# Altium schematic sheet Therms.SchDoc: Thermistor Fusing & Splitter
size A; DrawnBy: Matthew McCauley; Address4: 2.2.1; Revision: 1; SheetNumber: 1; SheetTotal: 1
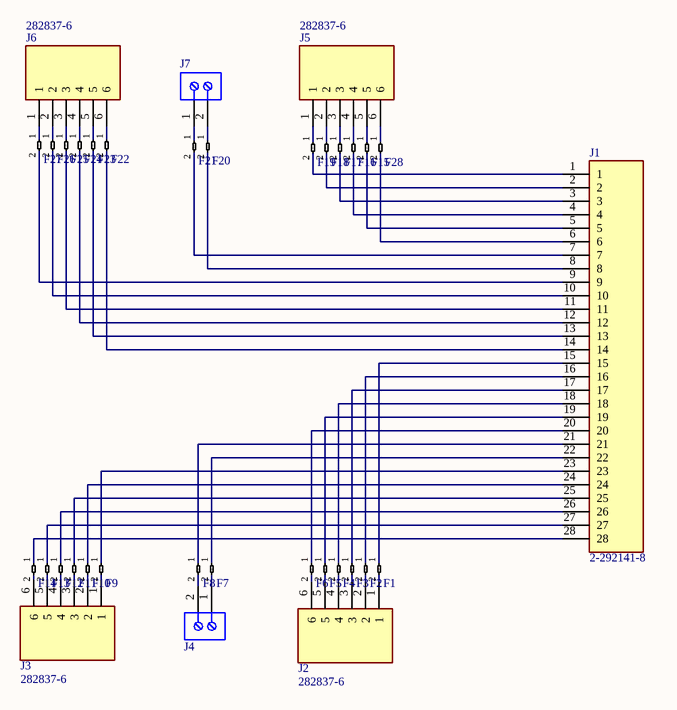
[diagram p0: Therms.SchDoc]

## Parts
F1  C1T5  [C1T5]  (value not drawn)
F2  C1T5  [C1T5]  (value not drawn)
F3  C1T5  [C1T5]  (value not drawn)
F4  C1T5  [C1T5]  (value not drawn)
F5  C1T5  [C1T5]  (value not drawn)
F6  C1T5  [C1T5]  (value not drawn)
F7  C1T5  [C1T5]  (value not drawn)
F8  C1T5  [C1T5]  (value not drawn)
F9  C1T5  [C1T5]  (value not drawn)
F10  C1T5  [C1T5]  (value not drawn)
F11  C1T5  [C1T5]  (value not drawn)
F12  C1T5  [C1T5]  (value not drawn)
F13  C1T5  [C1T5]  (value not drawn)
F14  C1T5  [C1T5]  (value not drawn)
F15  C1T5  [C1T5]  (value not drawn)
F16  C1T5  [C1T5]  (value not drawn)
F17  C1T5  [C1T5]  (value not drawn)
F18  C1T5  [C1T5]  (value not drawn)
F19  C1T5  [C1T5]  (value not drawn)
F20  C1T5  [C1T5]  (value not drawn)
F21  C1T5  [C1T5]  (value not drawn)
F22  C1T5  [C1T5]  (value not drawn)
F23  C1T5  [C1T5]  (value not drawn)
F24  C1T5  [C1T5]  (value not drawn)
F25  C1T5  [C1T5]  (value not drawn)
F26  C1T5  [C1T5]  (value not drawn)
F27  C1T5  [C1T5]  (value not drawn)
F28  C1T5  [C1T5]  (value not drawn)
J1  2-292141-8  [TE_2-292141-8]
J2  282837-6  [TE_282837-6]
J3  282837-6  [TE_282837-6]
J4  691102710002  [691102710002]  (value not drawn)
J5  282837-6  [TE_282837-6]
J6  282837-6  [TE_282837-6]
J7  691102710002  [691102710002]  (value not drawn)

## Nets
NetF1_1: F1.1 J1.15
NetF1_2: F1.2 J2.1
NetF2_1: F2.1 J1.16
NetF2_2: F2.2 J2.2
NetF3_1: F3.1 J1.17
NetF3_2: F3.2 J2.3
NetF4_1: F4.1 J1.18
NetF4_2: F4.2 J2.4
NetF5_1: F5.1 J1.19
NetF5_2: F5.2 J2.5
NetF6_1: F6.1 J1.20
NetF6_2: F6.2 J2.6
NetF7_1: F7.1 J1.22
NetF7_2: F7.2 J4.1
NetF8_1: F8.1 J1.21
NetF8_2: F8.2 J4.2
NetF9_1: F9.1 J1.23
NetF9_2: F9.2 J3.1
NetF10_1: F10.1 J1.24
NetF10_2: F10.2 J3.2
NetF11_1: F11.1 J1.25
NetF11_2: F11.2 J3.3
NetF12_1: F12.1 J1.26
NetF12_2: F12.2 J3.4
NetF13_1: F13.1 J1.27
NetF13_2: F13.2 J3.5
NetF14_1: F14.1 J1.28
NetF14_2: F14.2 J3.6
NetF15_1: F15.1 J5.5
NetF15_2: F15.2 J1.5
NetF16_1: F16.1 J5.4
NetF16_2: F16.2 J1.4
NetF17_1: F17.1 J5.3
NetF17_2: F17.2 J1.3
NetF18_1: F18.1 J5.2
NetF18_2: F18.2 J1.2
NetF19_1: F19.1 J5.1
NetF19_2: F19.2 J1.1
NetF20_1: F20.1 J7.2
NetF20_2: F20.2 J1.8
NetF21_1: F21.1 J7.1
NetF21_2: F21.2 J1.7
NetF22_1: F22.1 J6.6
NetF22_2: F22.2 J1.14
NetF23_1: F23.1 J6.5
NetF23_2: F23.2 J1.13
NetF24_1: F24.1 J6.4
NetF24_2: F24.2 J1.12
NetF25_1: F25.1 J6.3
NetF25_2: F25.2 J1.11
NetF26_1: F26.1 J6.2
NetF26_2: F26.2 J1.10
NetF27_1: F27.1 J6.1
NetF27_2: F27.2 J1.9
NetF28_1: F28.1 J5.6
NetF28_2: F28.2 J1.6

## Notes on the sheet
- Title
- Size:
- Date:
- A
- WBS:
- Time:
- Revision:
- Sheet
- of
- Drawn By:
- File:

## Library data of the parts
J1 = 2-292141-8: MF: {'manufacturer': 'TE Connectivity'}; Availability: Unavailable; MP: 2-292141-8; Package: None; Value: *; Price: None
J2 J3 J5 J6 = 282837-6: Conn Terminal Block F 6 POS 5.08mm Solder ST Thru-Hole 13.5A/Contact; MF: TE Connectivity; MP: 282837-6; SnapEDA_Link: https://www.snapeda.com/parts/282837-6/TE%20Connectivity%20AMP%20Connectors/view-part/520355/?ref=snap; TE_purchase_URL: https://www.te.com/usa-en/product-282837-6.html?te_bu=Cor&te_type=disp&te_campaign=seda_glo_cor-seda-global-disp-prtnr-fy19-seda-model-bom-cta_sma-317_1&elqCampaignId=32493; Value: *; Package: None; EU_RoHS_Compliance: Compliant with Exemptions; Price: None; Availability: Unavailable
J4 J7 = CMP-1502-03258-1: Series 102 - 5.00 mm Horizontal Entry Modular with Pressure Clamp WR-TBL, 2 pin; Manufacturer: Wurth Elektronik; Pin Number: 2; Pitch: 5.00mm; Manufacturer URL: http://www.we-online.de; Mounting Technology: THT; Publisher: WurthElektronik; Packaging: Box; Package Reference: 691102710002; Datasheet URL: http://katalog.we-online.de/em/datasheet/6911027100xx.pdf; Operating Temperature: -40to105degC; Part Number: 691102710002
F1-F28 = C1T5: ComponentLink1Description: New link; ComponentLink1URL: https://www.mouser.com/ProductDetail/Bel-Fuse/C1T5?qs=GtFly9OVs8%2FF1GxRAaUoTA%3D%3D#.Xzf8gWXWqWc.link